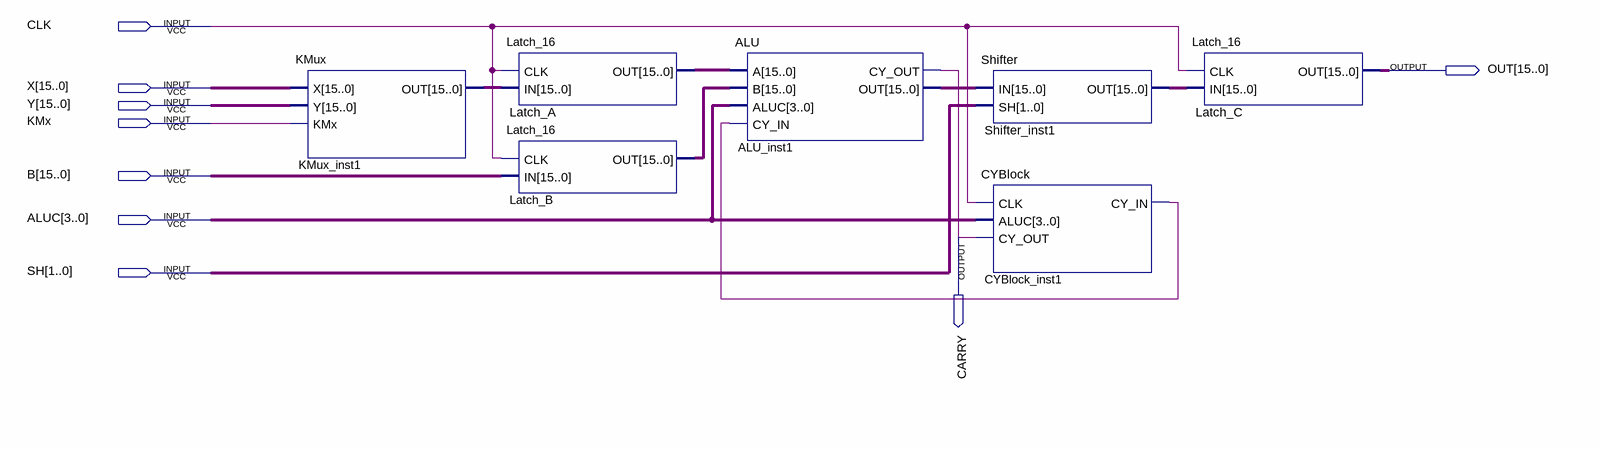
[diagram p0: schematic sheet]
// Quartus schematic ALU_SHIFTER_CYBLOCK_LATCH.bdf as structural Verilog: 7 symbols, 9 pins
module ALU_SHIFTER_CYBLOCK_LATCH (
  input  CLK,
  input  [15:0] X,
  input  [15:0] Y,
  input  KMx,
  input  [15:0] B,
  input  [3:0] ALUC,
  input  [1:0] SH,
  output [15:0] OUT,
  output CARRY
);

  wire CYBlock_inst1_cy_in;
  wire [15:0] ALU_inst1_out, KMux_inst1_out, Latch_A_out, Latch_B_out, Shifter_inst1_out;

  KMux KMux_inst1 (.X(X), .Y(Y), .KMx(KMx), .OUT(KMux_inst1_out));
  Latch_16 Latch_A (.CLK(CLK), .IN(KMux_inst1_out), .OUT(Latch_A_out));
  Latch_16 Latch_B (.CLK(CLK), .IN(B), .OUT(Latch_B_out));
  ALU ALU_inst1 (
    .A(Latch_A_out), .B(Latch_B_out), .ALUC(ALUC), .CY_IN(CYBlock_inst1_cy_in), .CY_OUT(CARRY),
    .OUT(ALU_inst1_out));
  Shifter Shifter_inst1 (.IN(ALU_inst1_out), .SH(SH), .OUT(Shifter_inst1_out));
  CYBlock CYBlock_inst1 (.CLK(CLK), .ALUC(ALUC), .CY_OUT(CARRY), .CY_IN(CYBlock_inst1_cy_in));
  Latch_16 Latch_C (.CLK(CLK), .IN(Shifter_inst1_out), .OUT(OUT));
endmodule
